# EasyEDA Pro project ProPrj_电容计量V2_2026-06-24.epro, schematic Schematic19
Create Date: 2026-05-07; Page Name: P1; Project Name: 电容计量V2; Schematic Name: Schematic19; Update Date: 2026-05-07; Page Size: A4; Version: V1.0
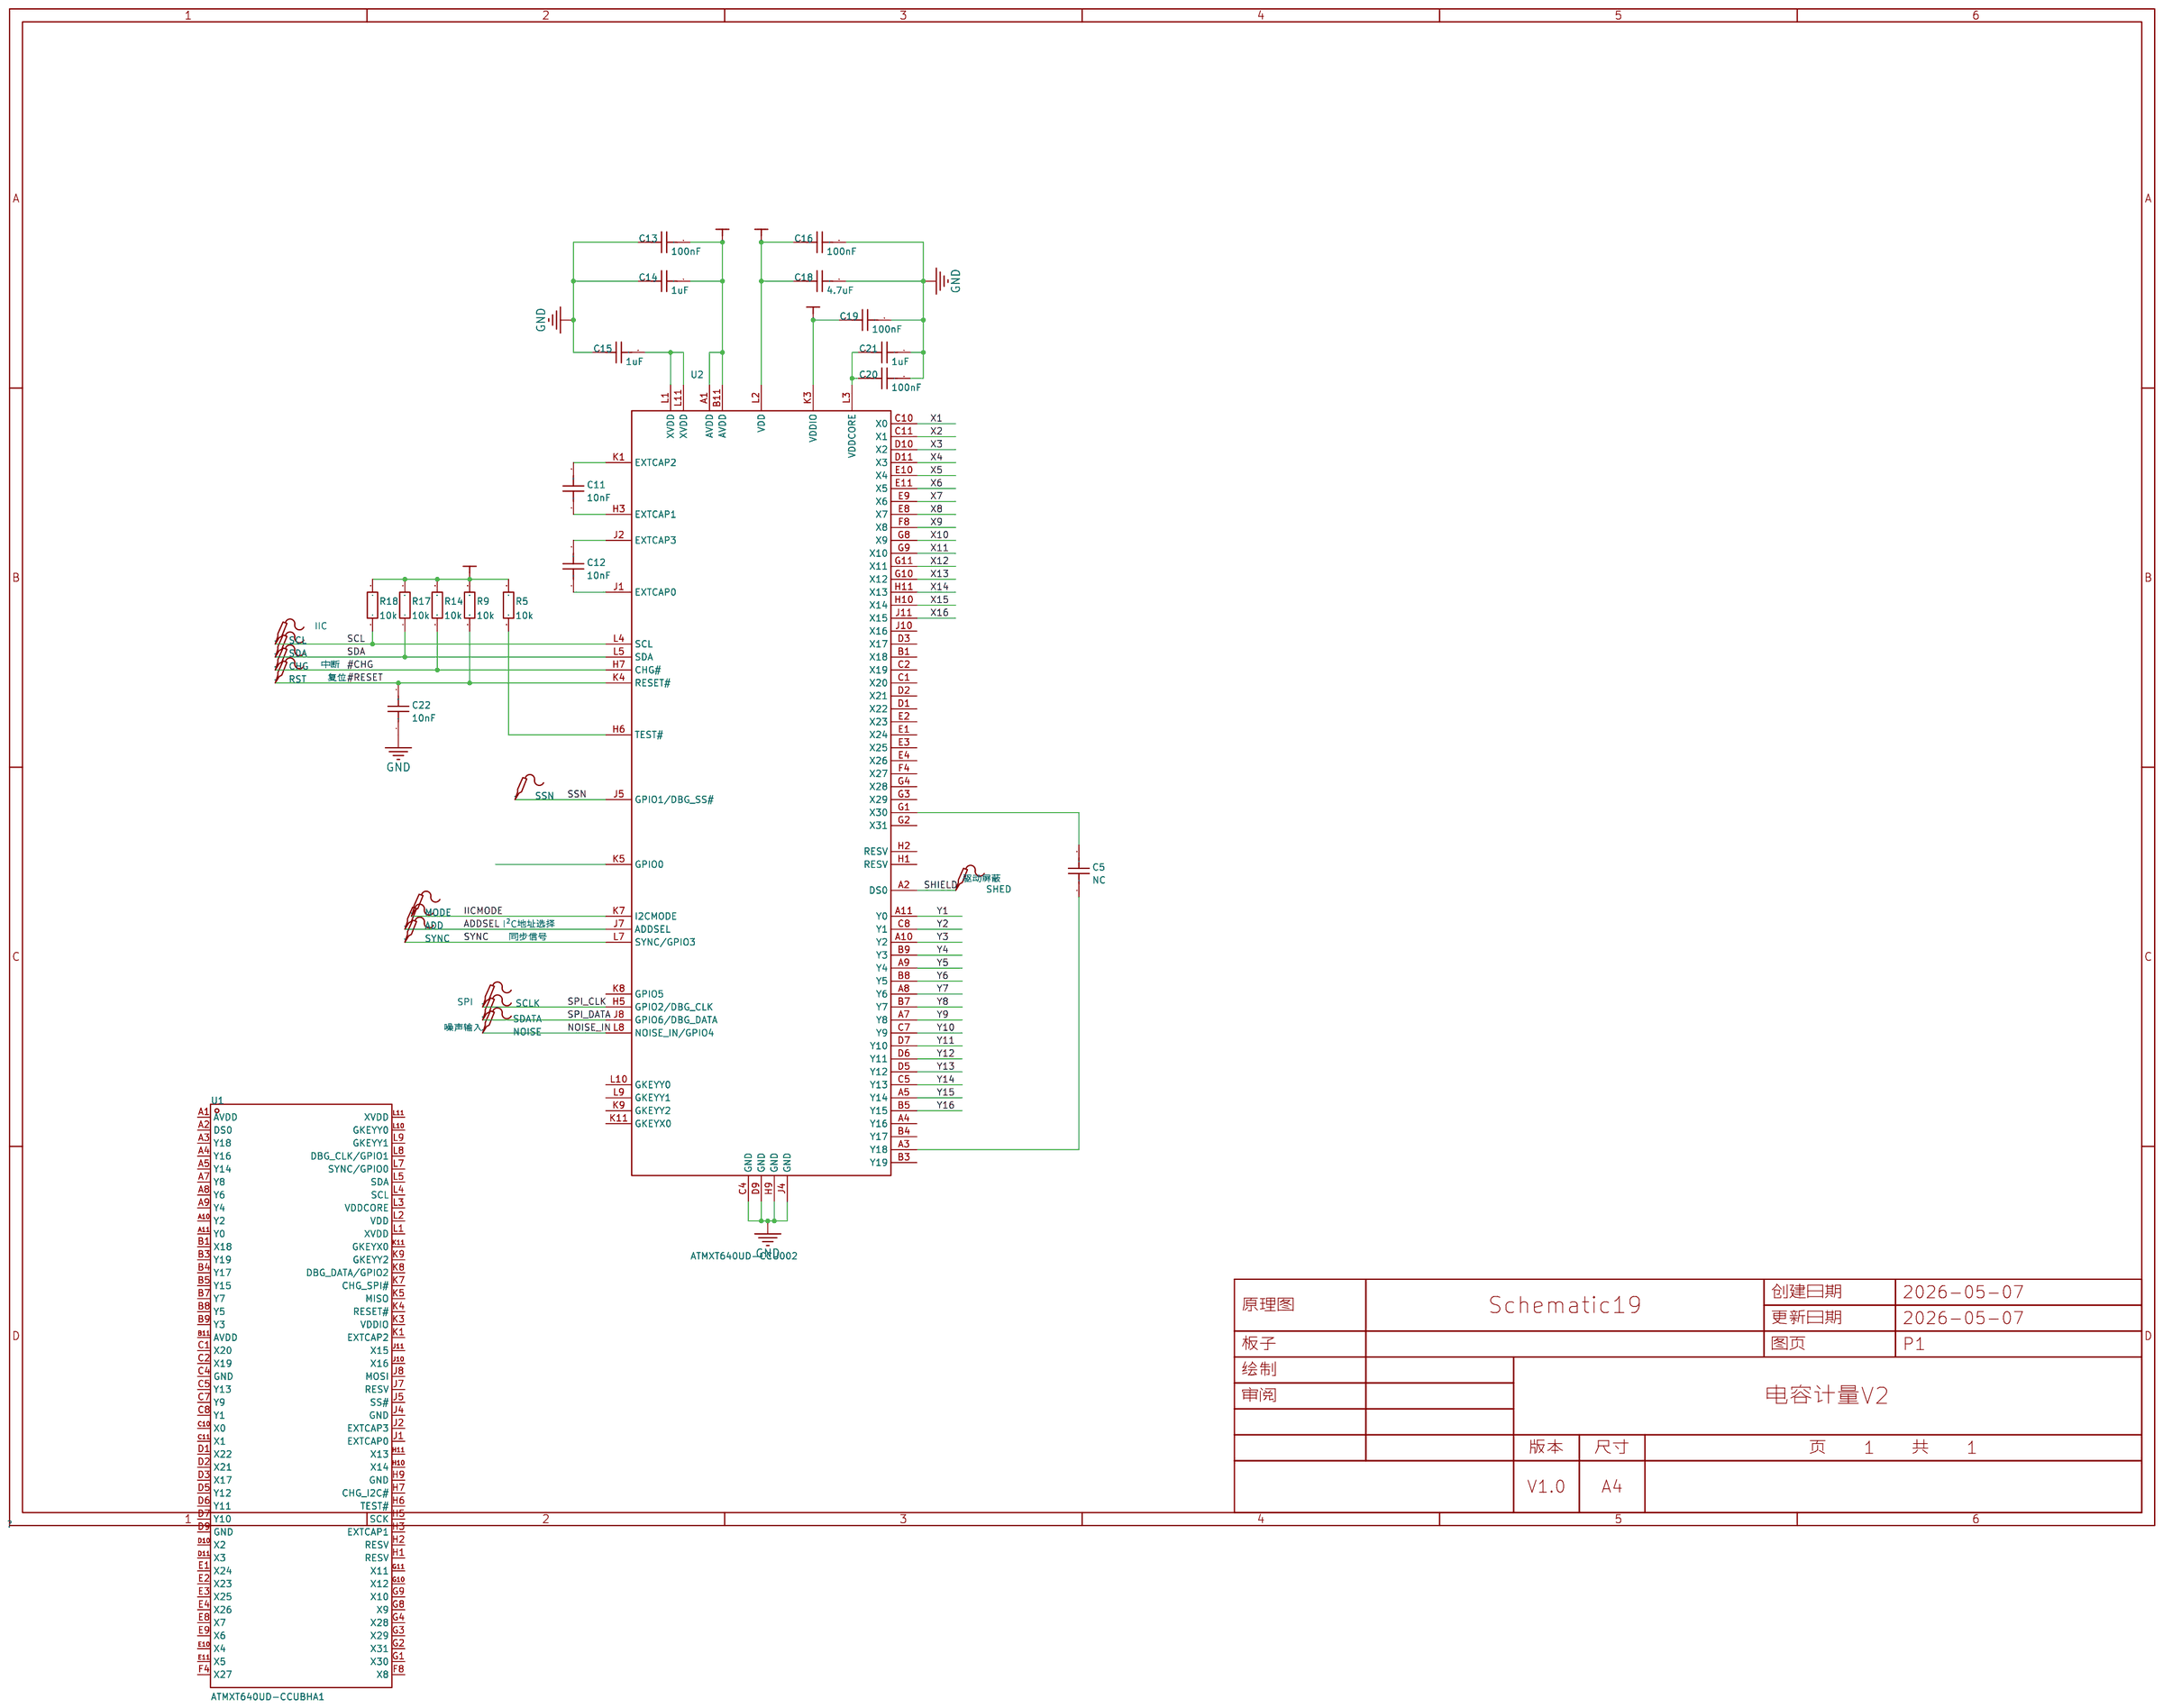
[diagram p2: schematic sheet]

## Parts
ADD  -  [Test-Point-0.5mm]
C5  NC  [C0402]
C11  10nF  [C0402]
C12  10nF  [C0402]
C13  100nF  [C0402]
C14  1uF  [C0402]
C15  1uF  [C0402]
C16  100nF  [C0402]
C18  4.7uF  [C0402]
C19  100nF  [C0402]
C20  100nF  [C0402]
C21  1uF  [C0402]
C22  10nF  [C0402]
CHG  -  [Test-Point-0.5mm]
MODE  -  [Test-Point-0.5mm]
NOISE  -  [Test-Point-0.5mm]
R5  10k  [R0402]
R9  10k  [R0402]
R14  10k  [R0402]
R17  10k  [R0402]
R18  10k  [R0402]
RST  -  [Test-Point-0.5mm]
SCL  -  [Test-Point-0.5mm]
SCLK  -  [Test-Point-0.5mm]
SDA  -  [Test-Point-0.5mm]
SDATA  -  [Test-Point-0.5mm]
SHED  -  [Test-Point-0.5mm]
SSN  -  [Test-Point-0.5mm]
SYNC  -  [Test-Point-0.5mm]
U1  ATMXT640UD-CCUBHA1  [UFBGA-88_L6.0-W6.0-P0.50-TL_MICROCHIP_ATMXT640UXXX]
U2  ATMXT640UD-CCU002  [UFBGA-88_L6.0-W6.0-P0.50-TL_MICROCHIP_ATMXT640UXXX]

## Library data of the parts
ADD CHG MODE NOISE RST SCL SCLK SDA SDATA SHED SSN SYNC = Test-Point: Test Point 测试点
C5 C11-C16 C18-C22 = CC0402KRX7R7BB104: 容值:100nF;精度:±10%;额定电压:16V;温度系数:X7R;; LCSC Part Name: 100nF ±10% 16V; Supplier Part: C60474; Manufacturer: YAGEO(国巨); Supplier Footprint: 0402; JLCPCB Part Class: Extended Part; Datasheet: https://atta.szlcsc.com/upload/public/pdf/source/20211223/9278FD768280B81DDBEF48FA36411A03.pdf; Supplier: LCSC; Tolerance: ±10%; Voltage Rated: 16V; Temperature Coefficient: X7R
R5 R9 R14 R17 R18 = 0603WAF1002T5E: LCSC Part Name: 10KΩ(1002) ±1% 编带; Supplier Part: C25804; Manufacturer: UNI-ROYAL(厚声); Supplier Footprint: 0603; JLCPCB Part Class: Basic Part; Datasheet: https://atta.szlcsc.com/upload/public/pdf/source/20170920/C25804_1505901551523983377.pdf; Supplier: LCSC
U1 = ATMXT640UD-CCUBHA1: Supplier Part: C6127893; Manufacturer: MICROCHIP(美国微芯); Supplier Footprint: UFBGA-88(6x6); JLCPCB Part Class: Extended Part; Datasheet: https://atta.szlcsc.com/upload/public/pdf/source/20230907/3CDC2C79B6B6FFB8E1E5EB03AD4CEAB6.pdf; Supplier: LCSC
U2 = ATMXT640UD-CCU002: Supplier Part: C20290559; Manufacturer: MICROCHIP(美国微芯); Supplier Footprint: UFBGA-88(6x6); JLCPCB Part Class: Extended Part; Datasheet: https://atta.szlcsc.com/upload/public/pdf/source/20240115/46BFA6860BFFF0995C0AE8E46E406903.pdf; Supplier: LCSC

## Nets
3V3: C13.1 C14.1 C16.2 C18.2 C19.2 R5.2 R9.2 R14.2 R17.2 R18.2 U2.A1(AVDD) U2.B11(AVDD) U2.K3(VDDIO) U2.L2(VDD)
GND: C13.2 C14.2 C15.2 C16.1 C18.1 C19.1 C20.1 C21.1 C22.1 U2.C4(GND) U2.D9(GND) U2.H9(GND) U2.J4(GND)
#CHG: CHG.1 R14.1 U2.H7(CHG#)
#RESET: C22.2 R9.1 RST.1 U2.K4(RESET#)
ADDSEL: ADD.1 U2.J7(ADDSEL)
IICMODE: MODE.1 U2.K7(I2CMODE)
NOISE_IN: NOISE.1 U2.L8(NOISE_IN/GPIO4)
SCL: R18.1 SCL.1 U2.L4(SCL)
SDA: R17.1 SDA.1 U2.L5(SDA)
SHIELD: SHED.1 U2.A2(DS0)
SPI_CLK: SCLK.1 U2.H5(GPIO2/DBG_CLK)
SPI_DATA: SDATA.1 U2.J8(GPIO6/DBG_DATA)
SSN: SSN.1 U2.J5(GPIO1/DBG_SS#)
SYNC: SYNC.1 U2.L7(SYNC/GPIO3)
X1: U2.C10(X0)
X2: U2.C11(X1)
X3: U2.D10(X2)
X4: U2.D11(X3)
X5: U2.E10(X4)
X6: U2.E11(X5)
X7: U2.E9(X6)
X8: U2.E8(X7)
X9: U2.F8(X8)
X10: U2.G8(X9)
X11: U2.G9(X10)
X12: U2.G11(X11)
X13: U2.G10(X12)
X14: U2.H11(X13)
X15: U2.H10(X14)
X16: U2.J11(X15)
Y1: U2.A11(Y0)
Y2: U2.C8(Y1)
Y3: U2.A10(Y2)
Y4: U2.B9(Y3)
Y5: U2.A9(Y4)
Y6: U2.B8(Y5)
Y7: U2.A8(Y6)
Y8: U2.B7(Y7)
Y9: U2.A7(Y8)
Y10: U2.C7(Y9)
Y11: U2.D7(Y10)
Y12: U2.D6(Y11)
Y13: U2.D5(Y12)
Y14: U2.C5(Y13)
Y15: U2.A5(Y14)
Y16: U2.B5(Y15)
Net-(C5-1): C5.1 U2.A3(Y18)
Net-(C5-2): C5.2 U2.G1(X30)
Net-(C11-1): C11.1 U2.H3(EXTCAP1)
Net-(C11-2): C11.2 U2.K1(EXTCAP2)
Net-(C12-1): C12.1 U2.J1(EXTCAP0)
Net-(C12-2): C12.2 U2.J2(EXTCAP3)
Net-(C15-1): C15.1 U2.L1(XVDD) U2.L11(XVDD)
Net-(C20-2): C20.2 C21.2 U2.L3(VDDCORE)
Net-(R5-1): R5.1 U2.H6(TEST#)

Not connected (* = marked no-connect by the designer): U1 A1(AVDD) A2(DS0) A3(Y18) A4(Y16) A5(Y14) A7(Y8) A8(Y6) A9(Y4) A10(Y2) A11(Y0) B1(X18) B3(Y19) B4(Y17) B5(Y15) B7(Y7) B8(Y5) B9(Y3) B11(AVDD) C1(X20) C2(X19) C4(GND) C5(Y13) C7(Y9) C8(Y1) C10(X0) C11(X1) D1(X22) D2(X21) D3(X17) D5(Y12) D6(Y11) D7(Y10) D9(GND) D10(X2) D11(X3) E1(X24) E2(X23) E3(X25) E4(X26) E8(X7) E9(X6) E10(X4) E11(X5) F4(X27) F8(X8) G1(X30) G2(X31) G3(X29) G4(X28) G8(X9) G9(X10) G10(X12) G11(X11) H1(RESV) H2(RESV) H3(EXTCAP1) H5(SCK) H6(TEST#) H7(CHG_I2C#) H9(GND) H10(X14) H11(X13) J1(EXTCAP0) J2(EXTCAP3) J4(GND) J5(SS#) J7(RESV) J8(MOSI) J10(X16) J11(X15) K1(EXTCAP2) K3(VDDIO) K4(RESET#) K5(MISO) K7(CHG_SPI#) K8(DBG_DATA/GPIO2) K9(GKEYY2) K11(GKEYX0) L1(XVDD) L2(VDD) L3(VDDCORE) L4(SCL) L5(SDA) L7(SYNC/GPIO0) L8(DBG_CLK/GPIO1) L9(GKEYY1) L10(GKEYY0) L11(XVDD); U2 A4(Y16) B1(X18) B3(Y19) B4(Y17) C1(X20) C2(X19) D1(X22) D2(X21) D3(X17) E1(X24) E2(X23) E3(X25) E4(X26) F4(X27) G2(X31) G3(X29) G4(X28) H1(RESV) H2(RESV) J10(X16) K5(GPIO0) K8(GPIO5) K9(GKEYY2) K11(GKEYX0) L9(GKEYY1) L10(GKEYY0)

## Notes on the sheet
- IIC
- 中断
- 复位
- 驱动屏蔽
- I²C地址选择
- 同步信号
- SPI
- 噪声输入
